# Altium schematic sheet Pyro.SchDoc
size A4; SheetNumber: 4; SheetTotal: 10
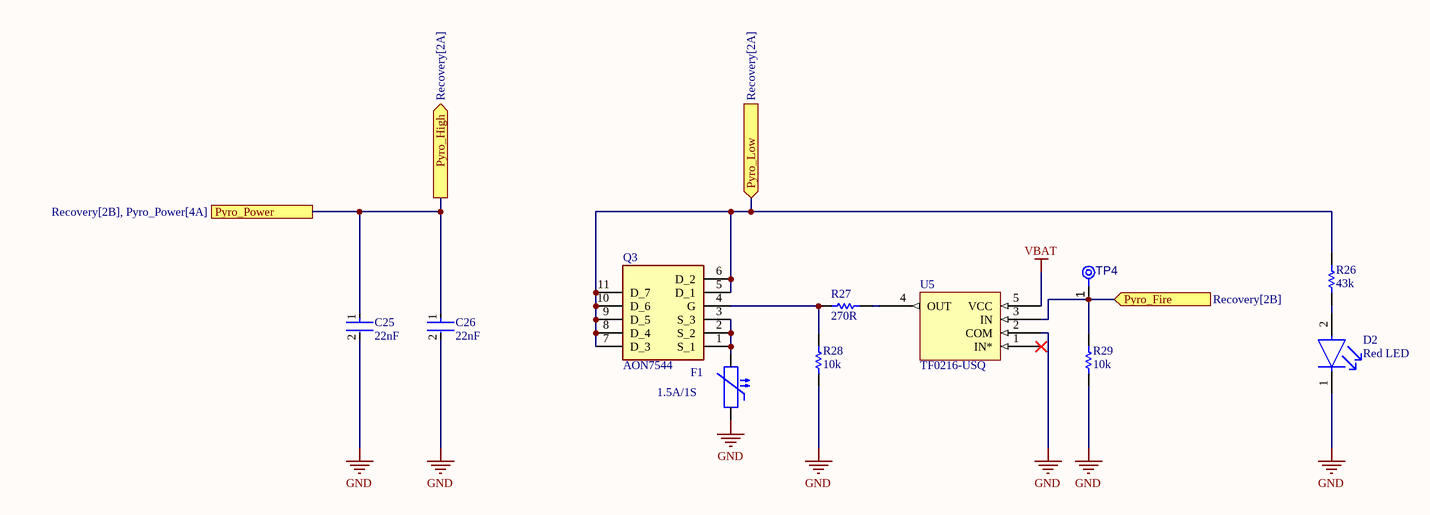
[diagram p0: Pyro.SchDoc]

## Parts
C25  value 22nF  [FP-0603-L_1_6_0_15-W_0_81-IPC_C]  (hidden comment: Generic-Capacitor)
C26  value 22nF  [FP-0603-L_1_6_0_15-W_0_81-IPC_C]  (hidden comment: Generic-Capacitor)
D2  Red LED  [FP-LTST-C190GKT-MFG]
F1  1.5A/1S  [RESC3115X65N]
Q3  AON7544  [AON7544]
R26  value 43k  [RESC1609X50X30ML8T20]  (hidden comment: Generic-Resistor)
R27  value 270R  [RESC1609X50X30ML8T20]  (hidden comment: Generic-Resistor)
R28  value 10k  [RESC1609X50X30ML8T20]  (hidden comment: Generic-Resistor)
R29  value 10k  [RESC1609X50X30ML8T20]  (hidden comment: Generic-Resistor)
TP4  TPAD6R  [TP06R]  (value not drawn)  (no BOM)
U5  TF0216-USQ  [SOT95P245X110-5N]

## Ports
Pyro_Fire (in, see Recovery[2B]), Pyro_High (out, see Recovery[2A]), Pyro_Low (in, see Recovery[2A]), Pyro_Power (see Recovery[2B], Pyro_Power[4A])

## Nets
GND: C25.2 C26.2 D2.1(C) F1.2 R28.1 R29.1 U5.2(COM)
VBAT: U5.5(VCC)
Pyro_Fire: R29.2 TP4.1(TP) U5.3(IN) ; port Pyro_Fire
Pyro_High: C25.1 C26.1 ; port Pyro_Power, port Pyro_High
Pyro_Low: Q3.5(D_1) Q3.6(D_2) Q3.7(D_3) Q3.8(D_4) Q3.9(D_5) Q3.10(D_6) Q3.11(D_7) R26.2 ; port Pyro_Low
NetD2_2: D2.2(A) R26.1
NetF1_1: F1.1 Q3.1(S_1) Q3.2(S_2) Q3.3(S_3)
NetQ3_4: Q3.4(G) R27.1 R28.2
NetR27_2: R27.2 U5.4(OUT)

Not connected (* = marked no-connect by the designer): U5 1(IN*)*

## Library data of the parts
C25 C26 = CMP-001-00088-6: Generic 0603 Capacitor; Dielectric: X7R; Voltage Rating: 50V; Tolerance: 10%; ESR: 0R; LCSC Part #: C21122; Case Code (Imperial): 0603
D2 = CMP-00026-00001-1: SZYY0603R; LCSC PART #: C434419
F1 = ASMD1206-075-30V: Polymeric PTC Resettable Fuse 30V 0.75A Surface Mount 1206; ComponentLink1Description: Datasheet; ComponentLink1URL: https://datasheet.lcsc.com/lcsc/2204011730_Shenzhen-JDT-Fuse-ASMD1206-075-30V_C2982268.pdf; Unit Price: 0.0525
Q3 = CMP-089-000000-2: MOSFET N Trench 30V 30A(Tc) 2.2V @ 250uA 5 m @ 20A,10V DFN-8_3x3 EP RoHS; Manufacturer_Name: Alpha & Omega Semiconductors; Geometry.Height: 0.9mm; Arrow Part Number: *; Mouser Price/Stock: *; Datasheet Link: https://datasheet.lcsc.com/lcsc/1912111437_Alpha---Omega-Semicon-AON7544_C315567.pdf; Mouser Part Number: *; Source: AON7544.SchLib; Design Item ID: AON7544; Manufacturer_Part_Number: AON7544; Arrow Price/Stock: *; LCSC Part #: C315567
R26-R29 = CMP-009-00185-4: Generic 0603 Resistor; Power Rating: 100mW; Tolerance: 0%; Voltage Rating: 75V; Case Code (Metric): 1608; Case Code (Imperial): 0603
  R26: LCSC Part #: C23172
  R27: LCSC Part #: C22966
  R28 R29: LCSC Part #: C25804
TP4 = CMP-00028-00002-2: 0.6mm round; Pins: 1
U5 = CMP-011-00013-1: High Speed, Low-Side, Single Gate Driver; LCSC Part #: C2683769